# EasyEDA Pro project ProPrj_DOGlove_MainBoard.epro, board DOGlove_MainBoard
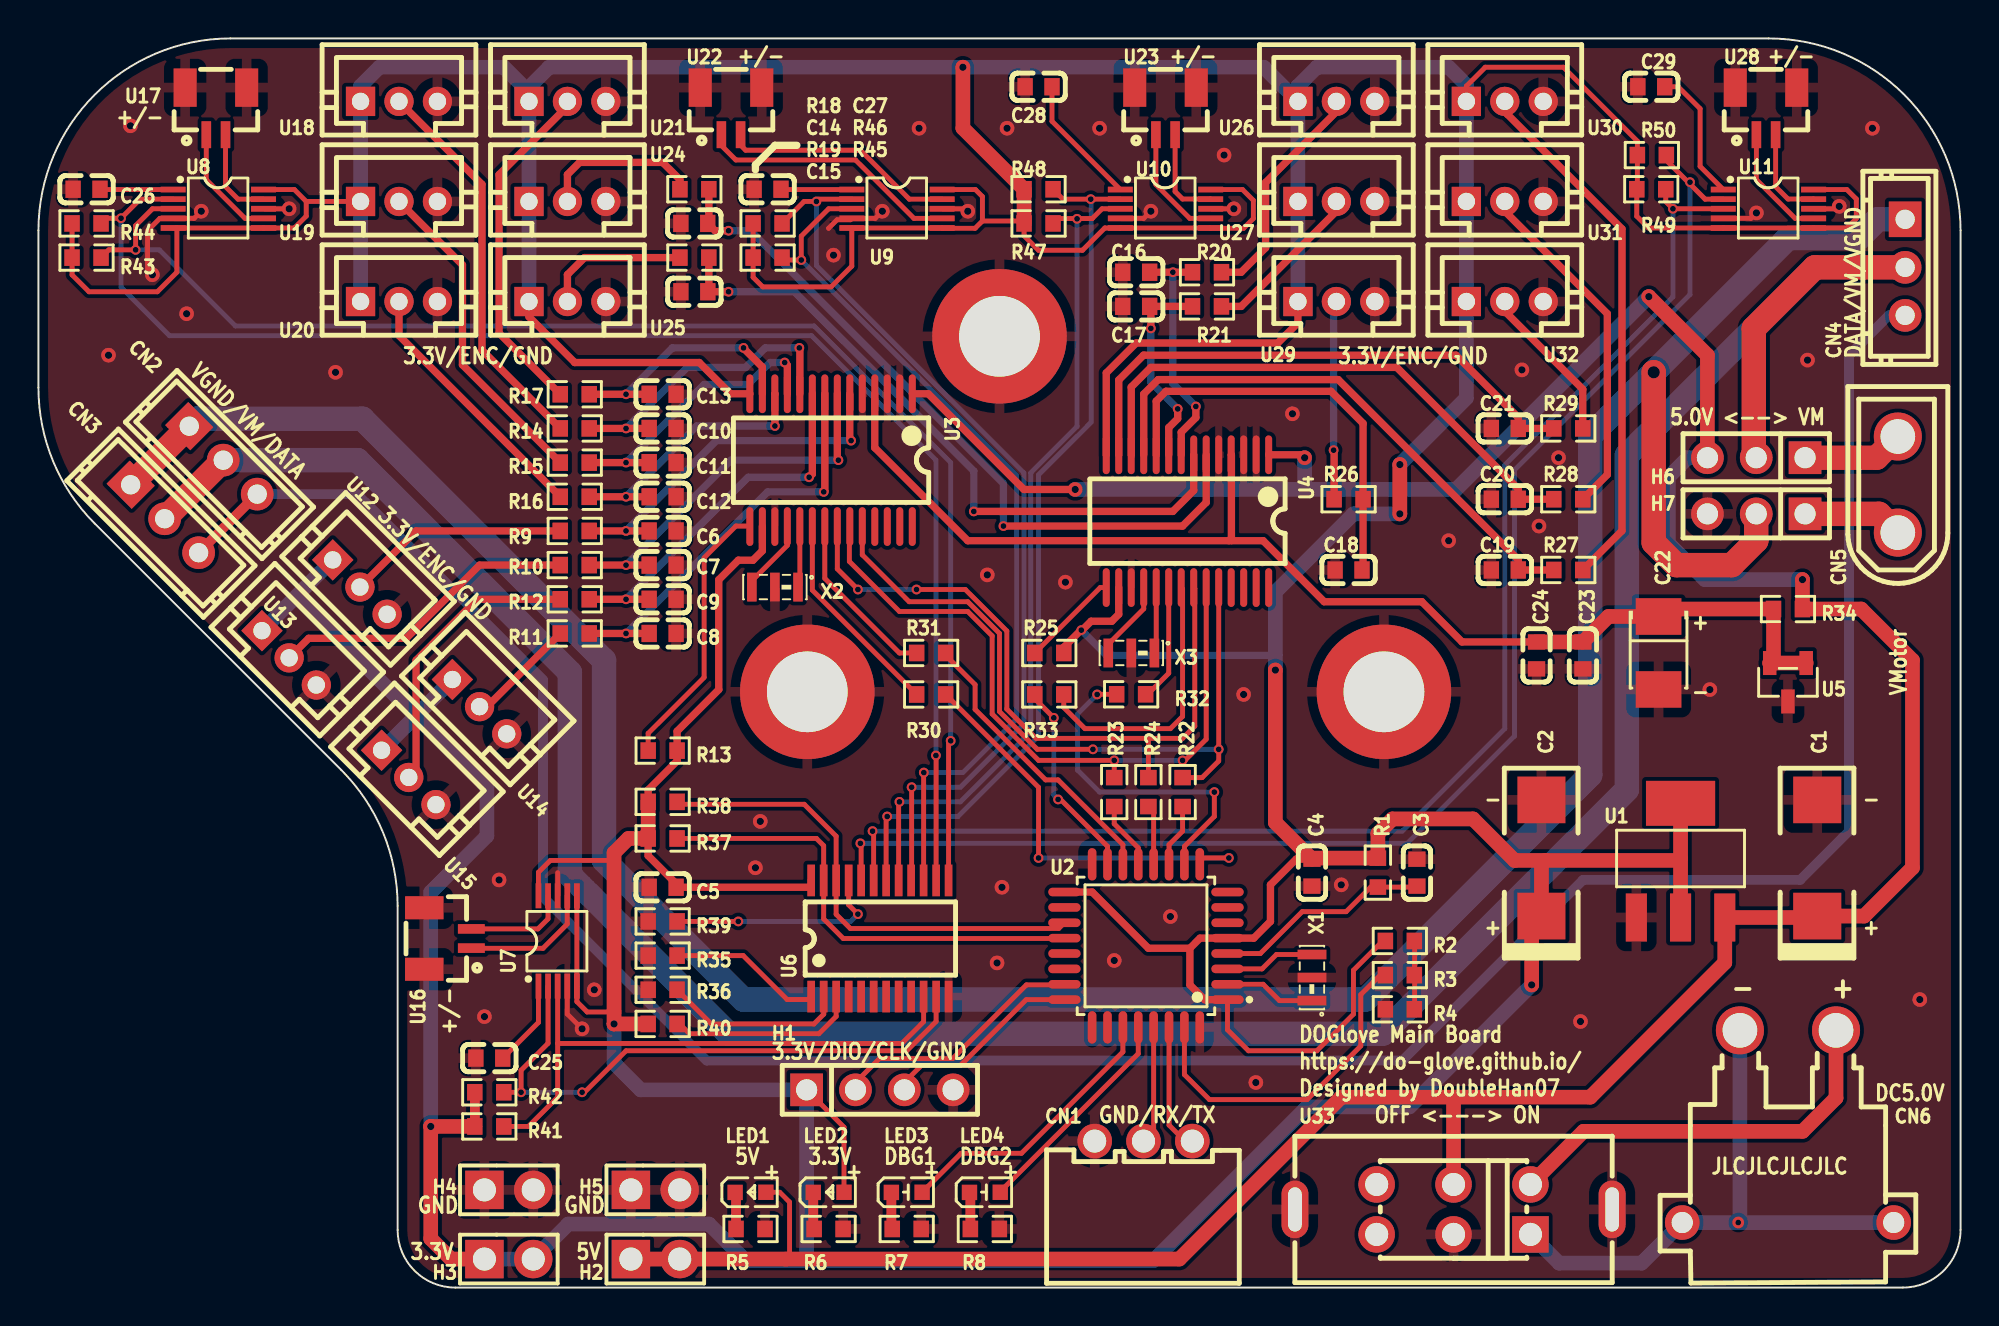
[diagram p5: board, top side]
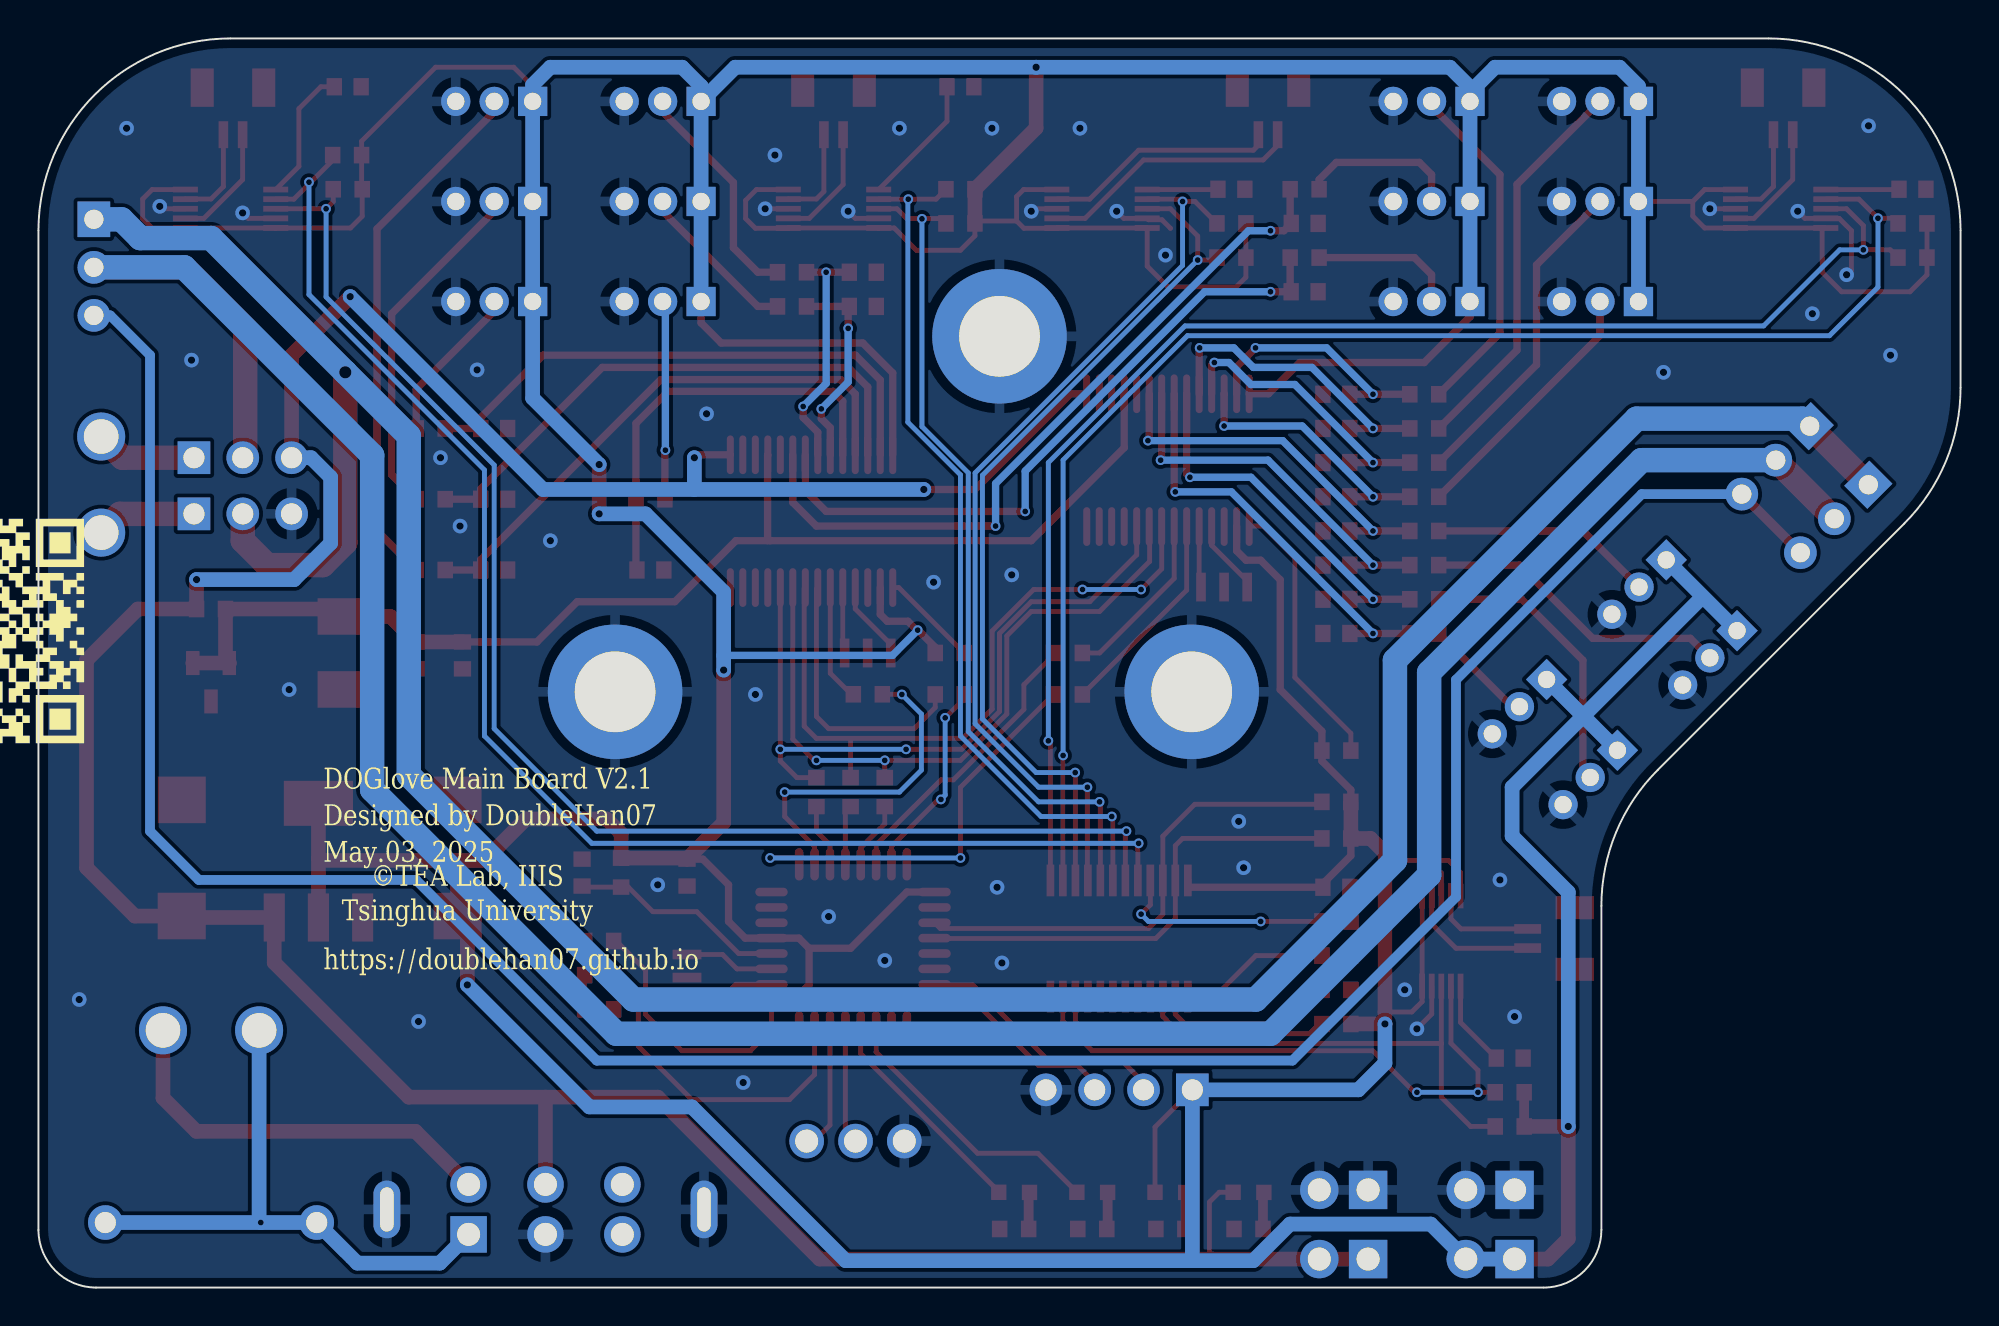
[diagram p6: board, bottom side, seen from below]

Outline 100 x 65 mm; copper layers: Top Layer, Bottom Layer. Coordinates in mm from the lower left corner of the outline.
Outline path: 0,55 0,46.83 arc(0.76,43) 2.93,39.76 15.76,26.93 arc(17.93,23.68) 18.69,19.86 18.69,3 arc(19.57,0.88) 21.69,0 97,0 arc(99.12,0.88) 100,3 100,55 arc(97.07,62.07) 90,65 10,65 arc(2.93,62.07) 0,55
Stack: Top Layer 0.035mm / Dielectric1 1.51mm FR4 er 4.5 / Bottom Layer 0.035mm

## Design rules (mm)
template: JLCPCB Capability(Two Layers Board)
spacing copperThickness1oz (default): track to track 0.102, other pairs 0.152 to 0.3
spacing copperThickness2oz: track to track 0.203, other pairs 0.152 to 0.3
track width copperThickness1oz (default): min 0.127, default 0.254, max 2.54
track width copperThickness2oz: min 0.203, default 0.254, max 2.54
differential pair differentialPair (default): width min 0.127, default 0.254, max 2.54; gap min 0.152, default 0.152
via viaSize (default): diameter min 0.5, default 0.61, max 10; hole min 0.3, default 0.305, max 6.3

## Placement (name value [footprint] x y rotation side)
C1  10uF  [CASE-C_6032]  92.55 22.35 270 top
C2  10uF  [CASE-C_6032]  78.19 22.35 270 top
C3  4.7uF  [C0603]  71.72 21.59 270 top
C4  100nF  [C0603]  66.26 21.59 90 top
C5  100nF  [C0603]  32.47 20.83 0 top
C6  10nF  [C0603]  32.47 39.37 180 top
C7  10nF  [C0603]  32.47 37.59 180 top
C8  10nF  [C0603]  32.47 34.04 180 top
C9  10nF  [C0603]  32.47 35.82 180 top
C10  10nF  [C0603]  32.48 44.71 180 top
C11  10nF  [C0603]  32.48 42.93 180 top
C12  10nF  [C0603]  32.48 41.15 180 top
C13  10nF  [C0603]  32.48 46.48 180 top
C14  10nF  [C0603]  34.12 55.37 0 top
C15  10nF  [C0603]  34.13 51.82 0 top
C16  10nF  [C0603]  57.11 52.83 0 top
C17  10nF  [C0603]  57.11 51.06 0 top
C18  10nF  [C0603]  68.16 37.34 0 top
C19  10nF  [C0603]  76.29 37.34 0 top
C20  10nF  [C0603]  76.29 41.02 0 top
C21  10nF  [C0603]  76.29 44.71 0 top
C22  47uF  [CAP-SMD_L3.5-W2.8-R-RD]  84.29 33.02 90 top
C23  100nF  [C0603]  80.35 32.9 90 top
C24  100pF  [C0603]  77.94 32.9 90 top
C25  1uF  [C0603]  23.46 11.94 180 top
C26  1uF  [C0603]  2.5 57.15 180 top
C27  1uF  [C0603]  37.94 57.15 180 top
C28  1uF  [C0603]  52.03 62.49 180 top
C29  1uF  [C0603]  83.91 62.49 180 top
CN1  XH-3AW  [CONN-TH_3P-P2.54_HCTL_XH-3AW]  57.49 7.62 180 top
CN2  B3B-EH-A(LF)(SN)  [CONN-TH_B3B-EH-A-LF-SN]  9.61 43.06 315 top
CN3  B3B-EH-A(LF)(SN)  [CONN-TH_B3B-EH-A-LF-SN]  6.57 40.01 315 top
CN4  B3B-EH-A(LF)(SN)  [CONN-TH_B3B-EH-A-LF-SN]  97.12 53.09 270 top
CN5  XT30UPB-M  [CONN-TH_XT30UPB-M]  96.74 41.79 90 top
CN6  XT30PW-M30.G.Y  [CONN-TH_XT30PW-M]  91.02 8.38 0 top
H1  PZ254V-11-04P  [HDR-TH_4P-P2.54-V-M]  43.78 10.29 0 top
H2  PZ254V-11-02P  [HDR-TH_2P-P2.54-V-M]  32.09 1.48 0 top
H3  PZ254V-11-02P  [HDR-TH_2P-P2.54-V-M]  24.47 1.48 0 top
H4  PZ254V-11-02P  [HDR-TH_2P-P2.54-V-M]  24.47 5.08 0 top
H5  PZ254V-11-02P  [HDR-TH_2P-P2.54-V-M]  32.09 5.08 0 top
H6  PZ254V-11-03P  [HDR-TH_3P-P2.54-V-M]  89.37 43.18 180 top
H7  PZ254V-11-03P  [HDR-TH_3P-P2.54-V-M]  89.37 40.26 180 top
LED1  NCD0603R1  [LED0603-RD_RED]  37.05 4.96 0 top
LED2  NCD0603R1  [LED0603-RD_RED]  41.11 4.96 0 top
LED3  NCD0603G1  [LED0603-RD_1]  45.17 4.96 0 top
LED4  NCD0603G1  [LED0603-RD_1]  49.24 4.96 0 top
NOREF  -  [Pad_e218]  70 31 0 top
NOREF#2  -  [Pad_e215]  50 49.5 0 top
NOREF#3  -  [Pad_e217]  40 31 0 top
R1  10kΩ  [R0603]  69.69 21.59 90 top
R2  NC  [R0603]  70.83 18.04 180 top
R3  10kΩ  [R0603]  70.83 16.26 180 top
R4  0Ω  [R0603]  70.83 14.48 0 top
R5  4.7kΩ  [R0603]  37.05 3.05 180 top
R6  4.7kΩ  [R0603]  41.11 3.05 180 top
R7  4.7kΩ  [R0603]  45.17 3.05 180 top
R8  4.7kΩ  [R0603]  49.24 3.05 180 top
R9  1kΩ  [R0603]  27.9 39.37 180 top
R10  1kΩ  [R0603]  27.9 37.59 180 top
R11  1kΩ  [R0603]  27.9 34.04 180 top
R12  1kΩ  [R0603]  27.9 35.82 180 top
R13  0Ω  [R0603]  32.47 27.94 0 top
R14  1kΩ  [R0603]  27.9 44.71 180 top
R15  1kΩ  [R0603]  27.9 42.93 180 top
R16  1kΩ  [R0603]  27.9 41.15 180 top
R17  1kΩ  [R0603]  27.9 46.48 180 top
R18  1kΩ  [R0603]  34.13 57.15 180 top
R19  1kΩ  [R0603]  34.13 53.6 180 top
R20  1kΩ  [R0603]  60.8 52.83 0 top
R21  1kΩ  [R0603]  60.8 51.06 0 top
R22  100Ω  [R0603]  59.52 25.78 270 top
R23  100Ω  [R0603]  55.97 25.78 270 top
R24  0Ω  [R0603]  57.75 25.78 90 top
R25  0Ω  [R0603]  52.59 33.02 0 top
R26  1kΩ  [R0603]  68.16 41.02 180 top
R27  1kΩ  [R0603]  79.59 37.34 0 top
R28  1kΩ  [R0603]  79.59 41.02 0 top
R29  1kΩ  [R0603]  79.59 44.71 0 top
R30  100Ω  [R0603]  46.44 30.86 0 top
R31  0Ω  [R0603]  46.44 33.02 180 top
R32  100Ω  [R0603]  56.85 30.87 180 top
R33  0Ω  [R0603]  52.59 30.86 0 top
R34  100Ω  [R0603]  91.02 35.31 180 top
R35  10kΩ  [R0603]  32.47 17.27 0 top
R36  10kΩ  [R0603]  32.47 15.5 0 top
R37  10kΩ  [R0603]  32.47 23.37 180 top
R38  10kΩ  [R0603]  32.47 25.28 180 top
R39  10kΩ  [R0603]  32.47 19.05 0 top
R40  10kΩ  [R0603]  32.47 13.72 180 top
R41  10kΩ  [R0603]  23.46 8.38 180 top
R42  10kΩ  [R0603]  23.46 10.16 180 top
R43  10kΩ  [R0603]  2.5 53.6 180 top
R44  10kΩ  [R0603]  2.5 55.37 180 top
R45  10kΩ  [R0603]  37.94 53.6 180 top
R46  10kΩ  [R0603]  37.94 55.37 180 top
R47  10kΩ  [R0603]  52.03 55.37 180 top
R48  10kΩ  [R0603]  52.03 57.15 180 top
R49  10kΩ  [R0603]  83.91 57.15 180 top
R50  10kΩ  [R0603]  83.94 58.93 180 top
U1  LM1117MPX-3.3/NOPB  [SOT-223-3_L6.5-W3.4-P2.30-LS7.0-BR]  85.43 22.23 270 top
U2  STM32F042K6T6  [LQFP-32_L7.0-W7.0-P0.80-LS9.0-BL]  57.62 17.78 90 top
U3  ADS1256IDBR  [SSOP-28_L10.2-W5.3-P0.65-LS7.8-BL]  41.24 43.06 180 top
U4  ADS1256IDBR  [SSOP-28_L10.2-W5.3-P0.65-LS7.8-BL]  59.78 39.88 180 top
U5  TL431BIDBZR  [SOT-23-3_L2.9-W1.3-P1.90-LS2.4-BR]  91.02 31.5 90 top
U6  PCA9548APW,118  [TSSOP-24_L7.8-W4.4-P0.65-LS6.4-BL]  43.78 18.16 0 top
U7  DRV2605LDGSR  [VSSOP-10_L3.0-W3.0-P0.50-LS4.9-BL]  27.01 18.04 0 top
U8  DRV2605LDGSR  [VSSOP-10_L3.0-W3.0-P0.50-LS4.9-BL]  9.36 56.14 270 top
U9  DRV2605LDGSR  [VSSOP-10_L3.0-W3.0-P0.50-LS4.9-BL]  44.67 56.14 270 top
U10  DRV2605LDGSR  [VSSOP-10_L3.0-W3.0-P0.50-LS4.9-BL]  58.64 56.14 270 top
U11  DRV2605LDGSR  [VSSOP-10_L3.0-W3.0-P0.50-LS4.9-BL]  90.01 56.14 270 top
U12  JS20T-S03PHA-00  [CONN-TH_3P-P2.00_BX-PH2.0-3PZZ]  16.73 36.45 315 top
U13  JS20T-S03PHA-00  [CONN-TH_3P-P2.00_BX-PH2.0-3PZZ]  13.04 32.77 315 top
U14  JS20T-S03PHA-00  [CONN-TH_3P-P2.00_BX-PH2.0-3PZZ]  22.95 30.23 315 top
U15  JS20T-S03PHA-00  [CONN-TH_3P-P2.00_BX-PH2.0-3PZZ]  19.27 26.55 315 top
U16  ZX-SH1.0-2PLT  [CONN-SMD_2P-P1.00_MEGASTAR_ZX-SH1.0-2PLT]  21.3 18.16 90 top
U17  ZX-SH1.0-2PLT  [CONN-SMD_2P-P1.00_MEGASTAR_ZX-SH1.0-2PLT]  9.23 61.22 0 top
U18  JS20T-S03PHA-00  [CONN-TH_3P-P2.00_BX-PH2.0-3PZZ]  18.76 61.72 0 top
U19  JS20T-S03PHA-00  [CONN-TH_3P-P2.00_BX-PH2.0-3PZZ]  18.76 56.52 0 top
U20  JS20T-S03PHA-00  [CONN-TH_3P-P2.00_BX-PH2.0-3PZZ]  18.76 51.31 0 top
U21  JS20T-S03PHA-00  [CONN-TH_3P-P2.00_BX-PH2.0-3PZZ]  27.52 61.72 0 top
U22  ZX-SH1.0-2PLT  [CONN-SMD_2P-P1.00_MEGASTAR_ZX-SH1.0-2PLT]  36.03 61.22 0 top
U23  ZX-SH1.0-2PLT  [CONN-SMD_2P-P1.00_MEGASTAR_ZX-SH1.0-2PLT]  58.64 61.22 0 top
U24  JS20T-S03PHA-00  [CONN-TH_3P-P2.00_BX-PH2.0-3PZZ]  27.52 56.52 0 top
U25  JS20T-S03PHA-00  [CONN-TH_3P-P2.00_BX-PH2.0-3PZZ]  27.52 51.31 0 top
U26  JS20T-S03PHA-00  [CONN-TH_3P-P2.00_BX-PH2.0-3PZZ]  67.53 61.72 0 top
U27  JS20T-S03PHA-00  [CONN-TH_3P-P2.00_BX-PH2.0-3PZZ]  67.53 56.52 0 top
U28  ZX-SH1.0-2PLT  [CONN-SMD_2P-P1.00_MEGASTAR_ZX-SH1.0-2PLT]  89.88 61.22 0 top
U29  JS20T-S03PHA-00  [CONN-TH_3P-P2.00_BX-PH2.0-3PZZ]  67.53 51.31 0 top
U30  JS20T-S03PHA-00  [CONN-TH_3P-P2.00_BX-PH2.0-3PZZ]  76.29 61.72 0 top
U31  JS20T-S03PHA-00  [CONN-TH_3P-P2.00_BX-PH2.0-3PZZ]  76.29 56.52 0 top
U32  JS20T-S03PHA-00  [CONN-TH_3P-P2.00_BX-PH2.0-3PZZ]  76.29 51.31 0 top
U33  SS-22F07-G100  [SW-TH_6P-L16.5-W7.5-P4.0-LS2.6-TL]  73.62 4.07 180 top
X1  -  [OSC-SMD_3P-L3.2-W1.3-P1.20]  66.26 16.13 90 top
X2  -  [OSC-SMD_3P-L3.2-W1.3-P1.20]  38.32 36.45 180 top
X3  -  [OSC-SMD_3P-L3.2-W1.3-P1.20]  56.86 33.02 180 top

## Footprints (pads in the part's own frame, mm; a bottom-side part is the same pattern mirrored in y, then rotated)
C0603
  rect 0.8x0.9 smd: 1(-0.7,0) 2(0.7,0)
CAP-SMD_L3.5-W2.8-R-RD
  rect 1.9x2.376 smd: 1(1.899,0) 2(-1.899,0)
CASE-C_6032
  rect 2.425x2.5 smd: 1(3.022,0) 2(-3.022,0)
CONN-SMD_2P-P1.00_MEGASTAR_ZX-SH1.0-2PLT
  rect 0.5x1.4 smd: 1(-0.5,-1.225) 2(0.5,-1.225)
  rect 1.2x2 smd: 3(1.6,1.225) 4(-1.6,1.225)
CONN-TH_3P-P2.00_BX-PH2.0-3PZZ
  rect 1.524x1.524 hole 0.9: 1(-2,0)
  round 1.524 hole 0.9: 2(0,0) 3(2,0)
CONN-TH_3P-P2.54_HCTL_XH-3AW
  round 1.8 hole 1.199: 1(-2.54,0) 2(0.002,0) 3(2.54,0)
CONN-TH_B3B-EH-A-LF-SN
  rect 1.85x1.7 hole 1: 1(-2.5,0)
  round 1.7 hole 1: 2(0,0) 3(2.5,0)
CONN-TH_XT30PW-M
  round 2.5 hole 1.8: 1(-2.5,5) 2(2.5,5)
  round 1.8 hole 1.1: 3(5.5,-5) 4(-5.5,-5)
CONN-TH_XT30UPB-M
  round 2.5 hole 1.8: 1(-2.5,0) 2(2.5,0)
HDR-TH_2P-P2.54-V-M
  rect 2x2 hole 1.2: 1(-1.27,0)
  round 2 hole 1.2: 2(1.27,0)
HDR-TH_3P-P2.54-V-M
  rect 1.7x1.7 hole 1.1: 1(-2.54,0)
  round 1.7 hole 1.1: 2(0,0) 3(2.54,0)
HDR-TH_4P-P2.54-V-M
  rect 1.7x1.7 hole 1.1: 1(-3.81,0)
  round 1.7 hole 1.1: 2(-1.27,0) 3(1.27,0) 4(3.81,0)
LED0603-RD_1
  rect 0.8x0.8 smd: 1(-0.799,-0.004) 2(0.799,0.004)
LED0603-RD_RED
  rect 0.8x0.8 smd: 1(-0.799,-0.004) 2(0.799,0.004)
LQFP-32_L7.0-W7.0-P0.80-LS9.0-BL
  oval 0.448x1.684 smd: 1(-2.8,-4.242) 2(-2,-4.242) 3(-1.2,-4.242) 4(-0.4,-4.242) 5(0.4,-4.242) 6(1.2,-4.242) 7(2,-4.242) 8(2.8,-4.242) 17(2.8,4.242) 18(2,4.242) 19(1.2,4.242) 20(0.4,4.242) 21(-0.4,4.242) 22(-1.2,4.242) 23(-2,4.242) 24(-2.8,4.242)
  oval 1.684x0.448 smd: 9(4.242,-2.8) 10(4.242,-2) 11(4.242,-1.2) 12(4.242,-0.4) 13(4.242,0.4) 14(4.242,1.2) 15(4.242,2) 16(4.242,2.8) 25(-4.242,2.8) 26(-4.242,2) 27(-4.242,1.2) 28(-4.242,0.4) 29(-4.242,-0.4) 30(-4.242,-1.2) 31(-4.242,-2) 32(-4.242,-2.8)
OSC-SMD_3P-L3.2-W1.3-P1.20
  rect 0.5x1.5 smd: 1(-1.2,0) 2(0,0) 3(1.2,0)
Pad_e215
  round 7 hole 4.2: 1(0,0)
Pad_e217
  round 7 hole 4.2: 1(0,0)
Pad_e218
  round 7 hole 4.2: 1(0,0)
R0603
  rect 0.806x0.864 smd: 1(-0.753,0) 2(0.753,0)
SOT-23-3_L2.9-W1.3-P1.90-LS2.4-BR
  rect 1.25x0.7 smd: 1(1,-0.95) 2(1,0.95) 3(-1,0)
SOT-223-3_L6.5-W3.4-P2.30-LS7.0-BR
  rect 2.5x1.1 smd: 1(2.97,-2.3) 2(2.97,0) 3(2.97,2.3)
  rect 2.34x3.6 smd: 4(-2.97,0)
SSOP-28_L10.2-W5.3-P0.65-LS7.8-BL
  oval 0.364x2.015 smd: 1(-4.225,-3.455) 2(-3.575,-3.455) 3(-2.925,-3.455) 4(-2.275,-3.455) 5(-1.625,-3.455) 6(-0.975,-3.455) 7(-0.325,-3.455) 8(0.325,-3.455) 9(0.975,-3.455) 10(1.625,-3.455) 11(2.275,-3.455) 12(2.925,-3.455) 13(3.575,-3.455) 14(4.225,-3.455) 15(4.225,3.455) 16(3.575,3.455) 17(2.925,3.455) 18(2.275,3.455) 19(1.625,3.455) 20(0.975,3.455) 21(0.325,3.455) 22(-0.325,3.455) 23(-0.975,3.455) 24(-1.625,3.455) 25(-2.275,3.455) 26(-2.925,3.455) 27(-3.575,3.455) 28(-4.225,3.455)
SW-TH_6P-L16.5-W7.5-P4.0-LS2.6-TL
  rect 1.9x1.9 hole 1.2: 1(-4,1.3)
  round 1.9 hole 1.2: 2(0,1.3) 3(4,1.3) 4(-4,-1.3) 5(0,-1.3) 6(4,-1.3)
  oval 1.4x3 hole 0.7x2.3: 7(-8.25,0) 8(8.25,0)
TSSOP-24_L7.8-W4.4-P0.65-LS6.4-BL
  rect 0.4x1.65 smd: 1(-3.575,-3.022) 2(-2.925,-3.022) 3(-2.275,-3.022) 4(-1.625,-3.022) 5(-0.975,-3.022) 6(-0.325,-3.022) 7(0.325,-3.022) 8(0.975,-3.022) 9(1.625,-3.022) 10(2.275,-3.022) 11(2.925,-3.022) 12(3.575,-3.022) 13(3.575,3.022) 14(2.925,3.022) 15(2.275,3.022) 16(1.625,3.022) 17(0.975,3.022) 18(0.325,3.022) 19(-0.325,3.022) 20(-0.975,3.022) 21(-1.625,3.022) 22(-2.275,3.022) 23(-2.925,3.022) 24(-3.575,3.022)
VSSOP-10_L3.0-W3.0-P0.50-LS4.9-BL
  rect 0.3x1.3 smd: 1(-1,-2.35) 2(-0.5,-2.35) 3(0,-2.35) 4(0.5,-2.35) 5(1,-2.35) 6(1,2.35) 7(0.5,2.35) 8(0,2.35) 9(-0.5,2.35) 10(-1,2.35)

## Nets
As in the schematic, except:
GND: C1.2 C2.2 C3.1 C4.1 C5.1 C6.1 C7.1 C8.1 C9.1 C10.1 C11.1 C12.1 C13.1 C14.1 C15.1 C16.1 C17.1 C18.1 C19.1 C20.1 C21.1 C22.2 C23.1 C24.1 C25.2 C26.2 C27.2 C28.2 C29.2 CN1.3 H1.4 H4.1 H4.2 H5.1 H5.2 H7.3 NOREF.1 NOREF#2.1 NOREF#3.1 R4.1 R5.1 R6.1 R7.1 R8.1 R35.1 R36.1 R39.1 U1.1 U2.16 U2.32 U3.2 U3.3 U3.5 U3.17 U4.2 U4.3 U4.5 U4.17 U5.3 U6.12 U7.4 U7.8 U8.4 U8.8 U9.4 U9.8 U10.4 U10.8 U11.4 U11.8 U12.3 U13.3 U14.3 U15.3 U16.3 U16.4 U17.3 U17.4 U18.3 U19.3 U20.3 U21.3 U22.3 U22.4 U23.3 U23.4 U24.3 U25.3 U26.3 U27.3 U28.3 U28.4 U29.3 U30.3 U31.3 U32.3 U33.2 U33.7 U33.8 X1.2 X2.2 X3.2

Pads without a net: U2 6 7 8 18 21 22 25 26; U3 25 26 27 28; U4 25 26 27 28; U6 4 5 6 7 8 9; U33 3 6

## Via types
v1: diameter 0.762, hole 0.381, Top Layer to Bottom Layer, 54 vias
v2: diameter 0.508, hole 0.305, Top Layer to Bottom Layer, 58 vias
v3: diameter 1.27, hole 0.635, Top Layer to Bottom Layer, 1 via
v4: diameter 0.61, hole 0.305, Top Layer to Bottom Layer, 1 via

## Routing (per net, layer and track width the routed paths; a pad name or vN(x,y) marks a point on that pad's centre or on a via; arc(x,y) is an arc through that point)
GND: length 21.4
  Top Layer w0.254: v1(48.35,56.01) 48.22,56.14 U9.8 ; v1(89.38,55.92) 89.09,55.64 U11.4 ; U10.8 v1(62.19,56.14) ; v1(93.69,56.26) 93.56,56.14 U11.8 ; U10.4 57.5,55.64 v1(57.87,56.01) ; U7.8 27.01,21.59 ; v1(8.47,56.01) 8.1,55.64 U8.4 6.32,55.64 5.68,55 5.68,52.95 v1(5.93,52.7) ; U8.8 v1(13.04,56.14) ; v1(28.28,13.46) 27.51,14.23 U7.4 ; v1(43.9,56.01) 43.53,55.64 U9.4 42.24,55.57 41.55,55.57 41.11,55.12 41.11,55.12
  vias: v1(3.65,48.52) v1(4.79,60.45) v1(7.71,50.68) v1(15.46,47.63) v1(23.2,14.1) v1(23.97,21.21) v1(28.92,15.5) v1(37.3,21.85) v1(37.55,24.26) v1(41.36,53.72) v1(45.81,60.33) v1(49.36,37.09) v1(49.87,16.89) v1(50.13,20.83) v1(50.39,60.33) v1(53.43,36.71) v1(55.21,60.33) v1(55.97,17.02) v1(58.89,19.31) v1(61.68,58.93) v1(62.7,30.86) v1(63.33,10.67) v1(65.24,45.47) v1(67.78,20.96) v1(73.37,38.86) v1(77.18,47.75) v1(78.07,39.63) v1(79.08,43.18) v1(80.23,13.84) v1(86.96,31.12) v1(92.04,48.26) v1(95.41,60.33) v1(97.88,14.99)
PGND: length 5.2
  Top Layer w1.27: H7.1 95.76,40.26 CN5.1
PVCC: length 5.3
  Top Layer w1.27: H6.1 95.63,43.18 CN5.2
VCC_3V3: length 562.9
  Top Layer w0.254: U11.10 94.08,57.14 94.58,56.64 94.58,55.63 94.08,55.14 U11.6 U11.5 83.77,55.14 83.16,55.75 R49.2 83.19,57.18 R50.2 83.19,59.65 79.34,63.5 75.27,63.5 74.29,62.52 U30.1 ; 7.19,55.14 U8.5 ; 7.19,55.14 U8.6 13.31,55.14 13.93,55.76 13.93,56.52 ; 7.19,55.14 7.2,55.12 7.2,52.83 6.19,51.82 2.63,51.82 1.75,52.7 R43.2 R44.2 ; U8.10 13.31,57.14 13.93,56.52 ; U9.10 48.75,57.14 49.11,56.77 49.11,55.5 ; H1.1 41.91,8.35 LED2.2 ; 29.95,14.34 28.55,14.34 28.01,14.88 U7.5 U7.6 ; 70.09,18.19 68.42,16.51 68.42,14.23 66.51,12.32 62.95,12.32 61.86,13.41 U2.1 ; 13.93,56.52 U19.1 ; R46.2 R45.2 37.18,52.57 37.68,52.07 41.24,52.07 42.32,53.15 U9.5 U9.6 47.03,55.12 48.73,55.12 49.11,55.5 ; 49.11,55.5 51.15,55.5 R47.2 51.28,54.73 52.03,53.98 54.32,53.98 55.48,55.14 U10.5 U10.6 61,55.12 62.7,55.12 63.21,55.63 63.21,56.57 62.64,57.14 U10.10 ; 29.68,22.23 26.63,22.23 26.01,21.61 U7.10
  Top Layer w0.381: U4.16 56.2,35.04 55.84,34.67 54.76,34.67 54.3,34.21 v2(54.26,34.21) 54.24,34.21 53.34,33.32 R25.2 ; U2.17 54.82,20.58 57.75,17.66 59.91,17.66 ; U3.14 36,46.51 34.38,48.14 27.9,48.14 25.52,50.52 U25.1 ; R38.2 31.72,25.9 33.23,27.4 R13.2 33.23,28.95 35.39,31.12 35.39,36.83 36.41,37.85 37.17,37.85 37.66,38.34 U3.16 ; 59.91,17.66 59.91,15.75 60.67,14.98 U2.1 ; 59.91,17.66 60.43,18.18 U2.5 63.23,18.18 64.1,19.05 64.1,20.96 65.43,22.29 C4.2 ; U6.24 40.2,20.83 C5.2 33.17,21.02 31.72,22.47 R37.2 ; U29.1 65.53,50.2 64.48,49.15 57.11,49.15 55.55,47.59 U4.14
  Top Layer w0.508: 22.71,8.38 22.71,10.16
  Top Layer w0.762: U1.4 85.43,22.33 ; 85.43,22.33 85.33,22.23 78.4,22.23 ; 85.43,22.33 U1.2 ; R40.2 v1(29.95,13.72) 29.95,22.62 30.7,23.37 R37.2 R38.2 ; R47.2 R48.2 48.1,60.34 v1(48.1,63.5) ; 78.4,22.23 78.19,22.02 C2.1 77.69,18.82 v1(77.69,15.75) ; 78.4,22.23 76.8,22.23 74.64,24.39 70.45,24.39 69.69,23.62 R1.2 66.31,22.35 C4.2 64.35,24.2 v1(64.35,32.13) ; H3.1 21.47,1.48 20.41,2.54 v1(20.41,8.38) R41.2 ; v1(70.83,40.26) v1(70.83,42.83)
  Bottom Layer w0.381: v2(54.26,34.21) 55.57,32.9 64.35,32.9
  Bottom Layer w0.762: 40.05,1.4 36.79,1.4 34.89,3.3 27.56,3.3 H3.2 H3.1 ; 40.05,1.4 58,1.4 66,9.4 71.34,9.4 v1(77.69,15.75) ; 40.05,1.4 39.97,1.48 H1.1 31.33,10.29 29.95,11.67 v1(29.95,13.72) ; 13.55,35.94 13.55,35.82 19.63,29.74 ; U26.1 U27.1 U29.1 ; U26.1 63.75,63.5 v1(48.1,63.5) 26.57,63.5 25.52,62.45 ; U26.1 65.53,62.52 66.51,63.5 73.37,63.5 74.29,62.58 U30.1 U31.1 U32.1 74.29,46.29 v1(70.83,42.83) ; 25.52,62.45 25.27,62.45 24.22,63.5 17.74,63.5 16.76,62.52 U18.1 U19.1 U20.1 ; 25.52,62.45 U21.1 U24.1 U25.1 ; 11.63,34.18 U12.1 ; v1(70.83,40.26) 68.42,40.26 64.35,36.2 v1(64.35,32.13) ; v1(20.41,8.38) 20.41,20.58 23.33,23.5 23.33,26.04 19.65,29.72 ; 19.63,29.74 U14.1 ; 19.63,29.74 17.85,27.96
VCC_5V: length 176.1
  Top Layer w0.254: LED1.2 38.57,4.96 39.08,4.45 39.08,1.68 38.88,1.48
  Top Layer w0.381: v1(65.88,43.18) 65.72,43.34 U4.1 ; U3.1 46.29,46.51 51.27,41.53 v1(53.94,41.53)
  Top Layer w0.762: 73.62,9.91 67.78,9.91 59.36,1.48 H2.2 H2.1 ; 73.62,9.91 U33.5 ; 73.62,9.91 80.73,9.91 87.73,16.91 U1.3 92.47,19.26 C1.1 94.98,19.33 97.5,21.85 97.5,32.64 94.83,35.31 R34.1 v1(91.77,36.84) ; H6.3 86.83,48.52 v1(83.78,51.56)
  Bottom Layer w0.762: v1(53.94,41.53) 65.88,41.53 ; 65.88,41.53 73.75,41.53 v1(83.78,51.56) ; 65.88,41.53 v1(65.88,43.18) ; v1(91.77,36.84) 86.69,36.84 84.8,38.74 84.8,42.17 85.81,43.18 H6.3
VCC_N: length 30.4
  Bottom Layer w0.762: v4(88.43,3.38) CN6.3 ; v4(88.43,3.38) 88.52,3.47 CN6.1 ; v4(88.43,3.38) CN6.4 83.41,1.27 79.12,1.27 U33.1
VCC_P: length 21.3
  Top Layer w0.762: CN6.2 93.52,9.87 91.78,8.13 80.39,8.13 U33.4
A0: length 8
  Top Layer w0.254: R35.2 36.67,17.27 38.95,14.99 40.05,14.99 U6.1
A1: length 9.5
  Top Layer w0.254: R36.2 35.01,13.72 40.35,13.72 40.86,14.23 40.86,15.14 U6.2
A2: length 11.5
  Top Layer w0.254: U6.21 42.15,19.92 v2(42.63,19.43) ; R39.2 v2(36.41,19.05)
  Bottom Layer w0.254: v2(36.41,19.05) 42.25,19.05 v2(42.63,19.43)
ADS1256_DRDY1: length 15.2
  Top Layer w0.254: R31.1 47.2,32.9 48.73,31.37 48.73,30.09 52.4,26.42 53.05,26.42 56.42,23.05 U2.14
ADS1256_DRDY2: length 10.5
  Top Layer w0.254: v2(53.05,25.4) 53.17,25.4 55.62,22.96 U2.15 ; v2(52.83,29.65) 51.84,30.64 R33.1
  Bottom Layer w0.254: v2(53.05,25.4) 52.83,25.62 v2(52.83,29.65)
AIN0: length 19.3
  Top Layer w0.381: U3.6 42.21,44.16 42.3,44.07 ; R9.1 C6.2
  Bottom Layer w0.381: v2(30.57,39.37) 35.27,44.07 42.3,44.07
  vias: v2(42.28,44.07)
AIN1: length 19.9
  Top Layer w0.381: C7.2 R10.1 ; v2(41.62,43.06) 41.56,43.11 U3.7
  Bottom Layer w0.381: v2(30.57,37.59) 36.03,43.06 v2(41.62,43.06)
AIN2: length 21.6
  Top Layer w0.381: v2(40.86,41.4) 40.91,41.46 U3.8 ; R11.1 C8.2
  Bottom Layer w0.381: v2(40.86,41.4) 37.94,41.4 v2(30.57,34.04)
AIN3: length 19.7
  Top Layer w0.381: C9.2 R12.1 ; v2(40.09,42.17) 40.26,42.33 U3.9
  Bottom Layer w0.381: v2(40.09,42.17) 36.92,42.17 v2(30.57,35.82)
AIN4: length 16.3
  Top Layer w0.381: U3.10 39.61,48.87 v2(39.59,48.9) ; 31.77,44.71 R14.1
  Bottom Layer w0.381: v2(30.57,44.71) 33.74,47.88 36.79,47.88 37.81,48.9 v2(39.59,48.9)
AIN5: length 15.2
  Top Layer w0.381: R15.1 31.77,42.93 ; U3.11 38.96,48 v2(38.82,48.14)
  Bottom Layer w0.381: v2(30.57,42.93) 34.63,46.99 36.92,46.99 38.06,48.14 v2(38.82,48.14)
AIN6: length 14.1
  Top Layer w0.381: v2(38.32,44.83) 38.32,46.51 U3.12 ; R16.1 31.77,41.15
  Bottom Layer w0.381: v2(38.32,44.83) 34.25,44.83 v2(30.57,41.15)
AIN7: length 13
  Top Layer w0.381: 31.77,46.48 R17.1 ; U3.13 37.66,47.9 36.67,48.9
  Bottom Layer w0.381: v2(36.68,48.9) 32.98,48.9 v2(30.57,46.48)
AIN8: length 38.5
  Top Layer w0.381: v2(50.2,39.63) 59.52,39.63 60.75,40.86 U4.6 ; v2(35.9,54.99) 35.2,54.99 C14.2 34.88,55.43 R18.1
  Bottom Layer w0.381: v2(50.2,39.63) 50.2,41.84 37.05,54.99 v2(35.9,54.99)
AIN9: length 35.4
  Top Layer w0.381: v2(48.66,40.39) 59.02,40.39 60.1,41.48 U4.7 ; v2(35.9,51.82) C15.2 34.88,51.87 R19.1
  Bottom Layer w0.381: v2(48.66,40.39) 48.66,42.49 39.33,51.82 v2(35.9,51.82)
AIN10: length 12.5
  Top Layer w0.381: C16.2 v2(59.02,52.83) R20.1 ; v2(60.22,45.85) 60.22,45.27 59.45,44.51 U4.8
  Bottom Layer w0.381: v2(60.22,45.85) 59.02,47.05 59.02,52.83
AIN11: length 10.7
  Top Layer w0.381: v2(59.27,45.72) 59.27,45.21 58.8,44.75 U4.9 ; v2(57.87,49.91) 57.87,50.99 C17.2 R21.1
  Bottom Layer w0.381: v2(59.27,45.72) 57.87,47.12 v2(57.87,49.91)
AIN12: length 22.1
  Top Layer w0.381: U4.10 58.15,46.13 58.66,46.64 67.25,46.64 68.91,44.97 R26.1 68.91,37.39 C18.2
AIN13: length 29.2
  Top Layer w0.381: U4.11 57.5,46.5 58.26,47.25 67.62,47.25 76.99,37.88 C19.2 R27.1
AIN14: length 29.1
  Top Layer w0.381: R28.1 C20.2 76.99,41.56 70.67,47.88 57.87,47.88 56.85,46.86 U4.12
AIN15: length 29
  Top Layer w0.381: U4.13 56.2,47.23 57.49,48.52 73.75,48.52 76.99,45.28 C21.2 R29.1
BOOT0: length 17.8
  Top Layer w0.254: 70.09,16.54 68.8,15.24 68.8,12.58 66,9.78 60.92,9.78 59.62,11.08 U2.31
CS1: length 11
  Top Layer w0.254: R30.1 40.26,36.29 U3.20
CS2: length 6.1
  Top Layer w0.254: U4.20 58.8,31.97 57.71,30.87 R32.1
DEBUG_LED1: length 14.7
  Top Layer w0.254: LED3.2 48,6.99 51.14,6.99 56.42,12.26 U2.27
DEBUG_LED2: length 11.6
  Top Layer w0.254: 50.04,4.96 50.04,4.99 57.22,12.18 U2.28
DIN: length 36.3
  Top Layer w0.254: U3.23 42.19,39.58 42.19,37.78 44.79,35.18 48.35,35.18 49.62,33.91 49.62,29.85 52.03,27.43 v2(55.97,27.43) R23.1 ; v2(59.52,27.43) 59.65,27.43 60.75,28.54 U4.23
  Bottom Layer w0.254: v2(55.97,27.43) v2(59.52,27.43)
DOUT: length 36.4
  Top Layer w0.254: 57.75,28.58 59.52,28.58 60.16,29.21 60.16,36.37 U4.22 ; 57.75,28.58 R24.2 ; 57.75,28.58 51.91,28.58 50.38,30.1 50.38,34.17 48.22,36.32 v2(45.68,36.32) ; v2(42.63,36.32) 41.56,37.4 U3.22
  Bottom Layer w0.254: v2(42.63,36.32) v2(45.68,36.32)
DRDY1: length 9.1
  Top Layer w0.254: U3.21 40.91,36.9 44.79,33.02 R31.2
DRDY2: length 14.3
  Top Layer w0.254: U4.21 59.52,36.35 59.52,29.72 58.89,29.09 54.45,29.09 53.34,30.19 R33.2
ENC0: length 11.6
  Top Layer w0.381: R9.2 19.65,39.37 U12.2
ENC1: length 16.1
  Top Layer w0.381: U13.2 14.06,33.78 19.14,33.78 22.95,37.59 R10.2
ENC2: length 5.8
  Top Layer w0.381: R11.2 23.34,30.23 U14.2
ENC3: length 15.1
  Top Layer w0.381: R12.2 22.82,35.82 19.65,32.64 19.65,26.93 U15.2
ENC4: length 20.5
  Top Layer w0.381: U18.2 23.08,57.41 23.08,48.78 R14.2
ENC5: length 17.1
  Top Layer w0.381: U19.2 22.06,53.22 22.06,48.02 R15.2
ENC6: length 13.6
  Top Layer w0.381: U20.2 18.76,49.54 R16.2
ENC7: length 18
  Top Layer w0.381: U21.2 27.52,61.47 23.97,57.91 23.97,49.67 R17.2
ENC8: length 8.4
  Top Layer w0.381: U24.2 27.52,57.91 28.16,58.55 32.47,58.55 33.37,57.65 R18.2
ENC9: length 7.6
  Top Layer w0.381: R19.2 28.41,53.6 27.52,52.71 U25.2
ENC10: length 12
  Top Layer w0.381: R20.2 62.57,52.83 63.84,54.1 63.84,57.5 67.53,61.19 U26.2
ENC11: length 8.5
  Top Layer w0.381: R21.2 62.57,51.06 67.53,56.01 U27.2
ENC12: length 10.4
  Top Layer w0.381: R26.2 67.41,43.55 v2(67.38,43.58)
  Bottom Layer w0.381: U29.2 67.38,51.17 v2(67.38,43.58)
ENC13: length 27.8
  Top Layer w0.381: R27.2 82.39,39.38 82.39,55.09 76.42,61.06 76.42,61.6 U30.2
ENC14: length 18.2
  Top Layer w0.381: U31.2 76.29,56.01 81.62,50.68 81.62,42.3 R28.2
ENC15: length 8.3
  Top Layer w0.381: U32.2 76.29,50.8 80.34,46.75 R29.2
I2C_SCL: length 25.4
  Top Layer w0.254: U2.19 53.08,18.69 42.24,18.69 41.5,19.42 U6.22 41.5,23.49 39.84,25.15 33.35,25.15 R38.1
I2C_SDA: length 24.5
  Top Layer w0.254: R37.1 40.48,23.37 40.85,22.99 U6.23 40.85,19.18 41.87,18.16 53.36,18.16 U2.20
LRA0_N: length 5.4
  Top Layer w0.254: U16.2 25.99,18.66 26.51,19.19 U7.9
LRA0_P: length 7
  Top Layer w0.254: U7.7 27.51,18.92 26.25,17.66 22.53,17.66 U16.1
LRA1_N: length 5
  Top Layer w0.254: U8.9 10.38,56.64 9.73,57.29 9.73,59.99
LRA1_P: length 6.2
  Top Layer w0.254: U8.7 10.75,55.64 8.73,57.65 8.73,59.99
LRA2_N: length 12.2
  Top Layer w0.254: U9.9 45.31,56.64 42.76,59.18 36.79,59.18 36.53,59.45 36.53,59.99
LRA2_P: length 13.6
  Top Layer w0.254: 35.53,59.99 35.53,59.43 36.28,58.68 42.51,58.68 45.55,55.64 U9.7
LRA3_N: length 5
  Top Layer w0.254: U10.9 60.98,56.64 59.52,56.64 59.14,57.03 59.14,59.99
LRA3_P: length 6.2
  Top Layer w0.254: U10.7 59.9,55.64 58.14,57.4 58.14,59.99
LRA4_N: length 5
  Top Layer w0.254: U11.9 92.35,56.64 91.02,56.64 90.38,57.29 90.38,59.99
LRA4_P: length 6.2
  Top Layer w0.254: U11.7 91.39,55.64 89.38,57.65 89.38,59.99
MDATA: length 139.4
  Top Layer w0.508: 11.38,41.29 8.33,38.24
  Bottom Layer w0.508: 11.38,41.29 16.59,41.29 26.25,31.62 26.25,20.32 34.76,11.81 70.95,11.81 80.35,21.21 91.66,21.21 94.2,23.75 94.2,48.52 96.27,50.59 CN4.3
MGND: length 156.1
  Top Layer w1.27: CN2.1 CN3.1 ; v3(84.04,47.63) 84.04,38.77 85.21,37.59 88.1,37.59 89.37,38.86 H7.2
  Bottom Layer w1.27: CN4.1 95.68,55.59 94.7,54.61 91.02,54.61 v3(84.04,47.63) 80.73,44.33 80.73,26.67 69.05,14.99 36.67,14.99 29.43,22.23 29.43,32.64 16.85,45.21 8.24,45.21 CN2.1
MVDD: length 153
  Top Layer w1.27: CN2.2 CN3.2 ; CN4.2 92.42,53.09 89.24,49.91 89.24,43.31 H6.2
  Bottom Layer w1.27: CN2.2 16.6,43.06 27.65,32.01 27.65,21.47 35.9,13.21 69.94,13.21 82.64,25.91 82.64,43.31 92.42,53.09 CN4.2
NRST: length 11.3
  Top Layer w0.254: C3.2 71.66,20.84 R1.1 69.31,20.84 68.03,19.56 65.75,19.56 63.57,17.38 U2.4
OSC_IN: length 4.7
  Top Layer w0.254: U2.2 63.72,15.78 64.57,14.93 X1.1
OSC_OUT: length 4.7
  Top Layer w0.254: X1.3 64.41,17.33 63.66,16.58 U2.3
SC3: length 31.4
  Top Layer w0.254: R42.1 v2(25.11,10.16) 25.11,11.31 26.51,12.71 U7.2 ; v2(28.28,10.16) 28.41,10.16 30.57,12.32 45.17,12.32 46.7,13.85 U6.11
  Bottom Layer w0.254: v2(25.11,10.16) v2(28.28,10.16)
SC4: length 75.9
  Top Layer w0.254: R44.1 3.53,55.65 v2(4.3,55.65) 5.29,56.64 U8.2 ; v2(46.69,27.69) 46.7,27.68 U6.14
  Bottom Layer w0.254: v2(4.3,55.65) 4.3,52.06 6.82,49.53 40.22,49.53 46.69,43.06 v2(46.69,27.69)
SC5: length 47.9
  Top Layer w0.254: R46.1 39.83,56.52 v2(40.48,56.52) 40.59,56.64 U9.2 ; v2(45.43,26.04) 45.43,21.21 U6.16
  Bottom Layer w0.254: v2(40.48,56.52) 40.48,53.19 51.27,42.39 51.27,29.34 47.97,26.04 v2(45.43,26.04)
SC6: length 45.7
  Top Layer w0.254: U10.2 v2(54.75,56.64) 53.3,56.64 R48.1 ; v2(44.16,24.51) 44.1,24.46 U6.18
  Bottom Layer w0.254: v2(44.16,24.51) 47.84,24.51 52.03,28.7 52.03,42.29 54.77,45.03 54.77,56.61 v2(54.75,56.64)
SC7: length 75
  Top Layer w0.254: U6.20 42.8,23.08 v2(42.76,23.12) ; U11.2 86.71,56.64 84.69,58.65 R50.1
  Bottom Layer w0.254: v2(85.92,57.52) 85.92,51.68 76.8,42.55 76.8,28.7 71.21,23.12 v2(42.76,23.12)
SCLK: length 37.8
  Top Layer w0.254: U3.24 42.86,38.13 45.3,35.69 48.35,35.69 50,34.04 50,29.97 51.97,28.01 v2(54.86,28.01) ; U4.24 v2(61.4,28.01) 61.4,27.4 60.54,26.54 R22.1
  Bottom Layer w0.254: v2(54.86,28.01) v2(61.4,28.01)
SD3: length 30
  Top Layer w0.254: U7.3 27.01,12.7 ; 27.01,12.7 44.92,12.7 46.05,13.83 U6.10 ; 27.01,12.7 27.01,9.91 25.49,8.38 R41.1
SD4: length 74.3
  Top Layer w0.254: U6.13 47.35,28.34 v2(47.46,28.45) ; U8.3 5.93,56.14 5.06,55.26 v2(5.06,54) 3.66,54 R43.1
  Bottom Layer w0.254: v2(47.46,28.45) 47.46,42.93 40.35,50.04 10.25,50.04 6.29,54 v2(5.06,54)
SD5: length 45.6
  Top Layer w0.254: v2(46.06,26.8) 46.05,26.79 U6.15 ; U9.3 41.11,56.14 39.69,54.71 v2(39.69,53.47) 38.82,53.47 R45.1
  Bottom Layer w0.254: v2(39.69,53.47) 50.89,42.27 50.89,29.59 48.1,26.8 v2(46.06,26.8)
SD6: length 43.9
  Top Layer w0.254: R47.1 53.04,55.63 54.83,55.63 55.33,56.14 U10.3 ; v2(44.79,25.28) 44.75,25.23 U6.17
  Bottom Layer w0.254: v2(44.79,25.28) 47.97,25.28 51.63,28.93 51.63,42.4 54.03,44.8 v2(54.03,55.61)
SD7: length 72.2
  Top Layer w0.254: R49.1 84.66,56.51 v2(85.04,56.14) U11.3 ; v2(43.4,23.75) 43.45,23.7 U6.19
  Bottom Layer w0.254: v2(85.04,56.14) 85.04,51.55 76.29,42.8 76.29,29.09 70.95,23.75 v2(43.4,23.75)
SPI_CLK: length 3.3
  Top Layer w0.254: R22.2 59.52,23.75 58.82,23.05 U2.11
SPI_CS1: length 22.3
  Top Layer w0.254: U2.9 60.42,22.35 v2(61.93,22.35) ; v2(52.03,22.35) 52.03,26.03 R30.2
  Bottom Layer w0.254: v2(52.03,22.35) v2(61.93,22.35)
SPI_CS2: length 17.4
  Top Layer w0.254: v2(55.08,30.86) 55.09,30.87 R32.2 ; v2(61.18,25.78) 61.18,24.51 59.62,22.96 U2.10
  Bottom Layer w0.254: v2(55.08,30.86) 54.06,29.85 54.06,26.93 55.21,25.78 v2(61.18,25.78)
SPI_MISO: length 3.1
  Top Layer w0.254: R24.1 58.02,24.76 U2.12
SPI_MOSI: length 3.5
  Top Layer w0.254: U2.13 57.22,22.88 55.97,24.13 R23.2
SWCLK: length 10.5
  Top Layer w0.254: H1.3 45.05,10.67 45.94,11.56 47.97,11.56 51.39,14.98 U2.24
SWDIO: length 13.4
  Top Layer w0.254: U2.23 53.35,15.75 51.4,15.75 47.56,11.92 43.75,11.92 42.51,10.67 H1.2
USART1_RX: length 6.6
  Top Layer w0.254: U2.30 58.82,8.45 59.65,7.62 CN1.1
USART1_TX: length 6.1
  Top Layer w0.254: U2.29 58.02,8.15 CN1.2
VREF: length 63.8
  Top Layer w0.381: 62.07,38.99 62.07,38.86 63.72,38.86 66.89,35.69 71.97,35.69 74.07,33.59 77.94,33.59 ; 62.07,38.99 61.94,38.86 48.35,38.86 43.51,43.7 U3.4 ; 62.07,38.99 62.07,43.32 U4.4
  Top Layer w0.762: U5.1 U5.2 90.27,32.69 R34.2 84.68,35.31 C22.1 81.68,34.92 80.35,33.59 77.94,33.59
$1N612: length 3.3
  Top Layer w0.254: 71.6,18.04 71.6,16.77 71.6,16.77 71.6,14.75 71.58,14.73
$1N1084: length 1.9
  Top Layer w0.508: LED2.1 40.31,3.1 R6.2
$1N1088: length 1.9
  Top Layer w0.508: LED3.1 44.37,3.1 R7.2
$1N1092: length 1.9
  Top Layer w0.508: 48.44,4.96 48.48,4.91 R8.2
$1N1095: length 1.9
  Top Layer w0.508: R5.2 36.29,4.91 LED1.1
$2N619: length 14.3
  Top Layer w0.254: U3.15 36.99,39.63 36.28,39.63 34.63,37.98 34.63,31.75 31.72,28.84 R13.1
$2N6200: length 5.1
  Top Layer w0.254: R25.1 55.24,36.43 U4.15
$2N12226: length 3.9
  Top Layer w0.254: X2.3 37.12,36.78 38.96,38.62 U3.18
$2N12237: length 3.2
  Top Layer w0.254: X2.1 39.61,36.55 U3.19
$2N12302: length 4.2
  Top Layer w0.254: U4.18 57.5,35.32 55.66,33.47 X3.3
$2N12311: length 3.4
  Top Layer w0.254: X3.1 58.15,33.12 U4.19
$3N428: length 9.9
  Top Layer w0.254: R40.1 33.36,13.72 33.87,13.21 40.6,13.21 41.5,14.11 U6.3
$3N4299: length 4.5
  Top Layer w0.254: U7.1 26.01,13.8 C25.1
$3N4649: length 3.8
  Top Layer w0.254: C26.1 3.22,57.14 U8.1
$3N4999: length 3.7
  Top Layer w0.254: U9.1 38.65,57.14 C27.1
$3N5647: length 6.8
  Top Layer w0.254: U10.1 52.73,60.69 C28.1
$3N5690: length 7
  Top Layer w0.254: U11.1 86.45,58.34 86.45,61.34 85.31,62.49 C29.1

## Copper pours and planes (outline as drawn; the poured copper is in the pictures)
GND on Top Layer: -0.04,65.03 100.04,65.03 100.04,0 -0.04,0
GND on Bottom Layer: -0.04,65.03 100.04,65.03 100.04,0 -0.04,0

## Text on the board
Bottom Silkscreen Layer: ©TEA Lab, IIIS / Tsinghua University | DOGlove Main Board V2.1 | Designed by DoubleHan07 | May.03, 2025 | https://doublehan07.github.io
Top Silkscreen Layer: VGND/VM/DATA | 3.3V/ENC/GND | +/- | 3.3V | GND | 5V | + | 3.3V/DIO/CLK/GND | DBG1 | DBG2 | GND/RX/TX | DOGlove Main Board | https://do-glove.github.io/ | Designed by DoubleHan07 | OFF <---> ON | - | 5.0V <--> VM | JLCJLCJLCJLC | DC5.0V | DATA/VM/VGND | VMotor
